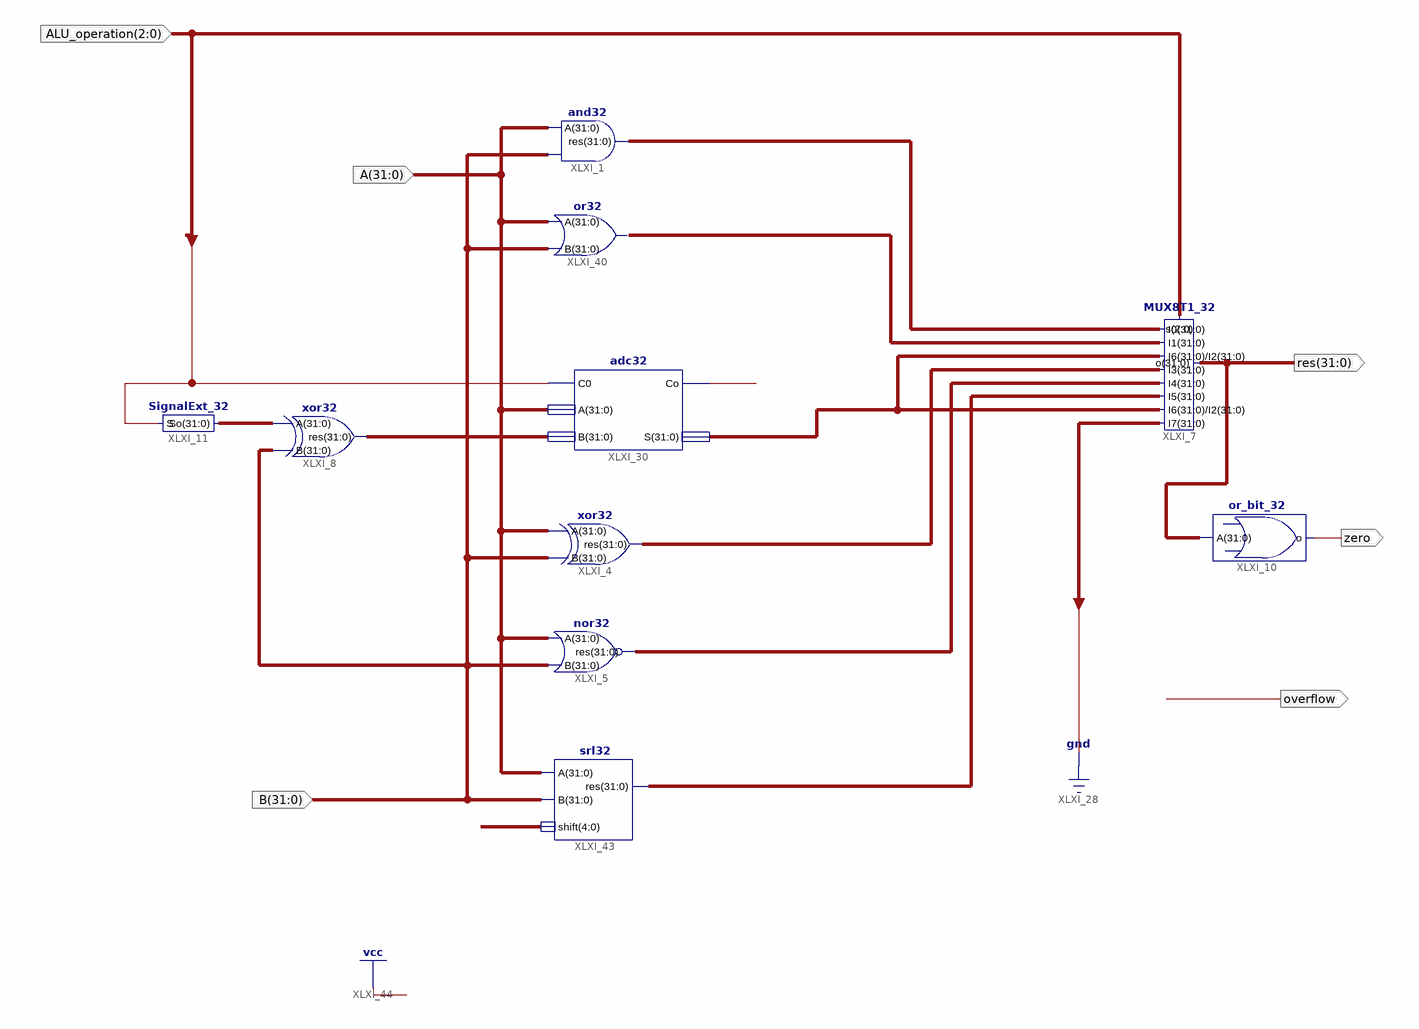
[diagram p0: schematic sheet 1]
// Xilinx ISE schematic ALU.sch (kintex7) as structural Verilog: 10 symbols, 6 ports
module ALU (
  input  [31:0] A,
  input  [31:0] B,
  input  [2:0] ALU_operation,
  output [31:0] res,
  output zero,
  output overflow
);

  wire Co;
  wire [31:0] XLXN_2, XLXN_4, XLXN_5, XLXN_6, XLXN_7, XLXN_8, XLXN_16, XLXN_23;

  and32 XLXI_1 (.res(XLXN_8), .A(A), .B(B));
  xor32 XLXI_4 (.A(A), .B(B), .res(XLXN_6));
  nor32 XLXI_5 (.res(XLXN_5), .A(A), .B(B));
  MUX8T1_32 XLXI_7 (
    .s(ALU_operation), .I7({{31{1'b0}}, Co}), .I6(XLXN_2), .I5(XLXN_4), .I4(XLXN_5), .I3(XLXN_6),
    .I2(XLXN_2), .I1(XLXN_7), .I0(XLXN_8), .o(res));
  xor32 XLXI_8 (.A(XLXN_23), .B(B), .res(XLXN_16));
  or_bit_32 XLXI_10 (.o(zero), .A(res));
  SignalExt_32 XLXI_11 (.So(XLXN_23), .S(ALU_operation[2]));
  adc32 XLXI_30 (.C0(ALU_operation[2]), .A(A), .B(XLXN_16), .Co(Co), .S(XLXN_2));
  or32 XLXI_40 (.res(XLXN_7), .A(A), .B(B));
  srl32 XLXI_43 (.A(A), .B(B), .shift(B[10:6]), .res(XLXN_4));
endmodule
